# Altium schematic sheet 2-Charge&Discharge.SchDoc
size A4
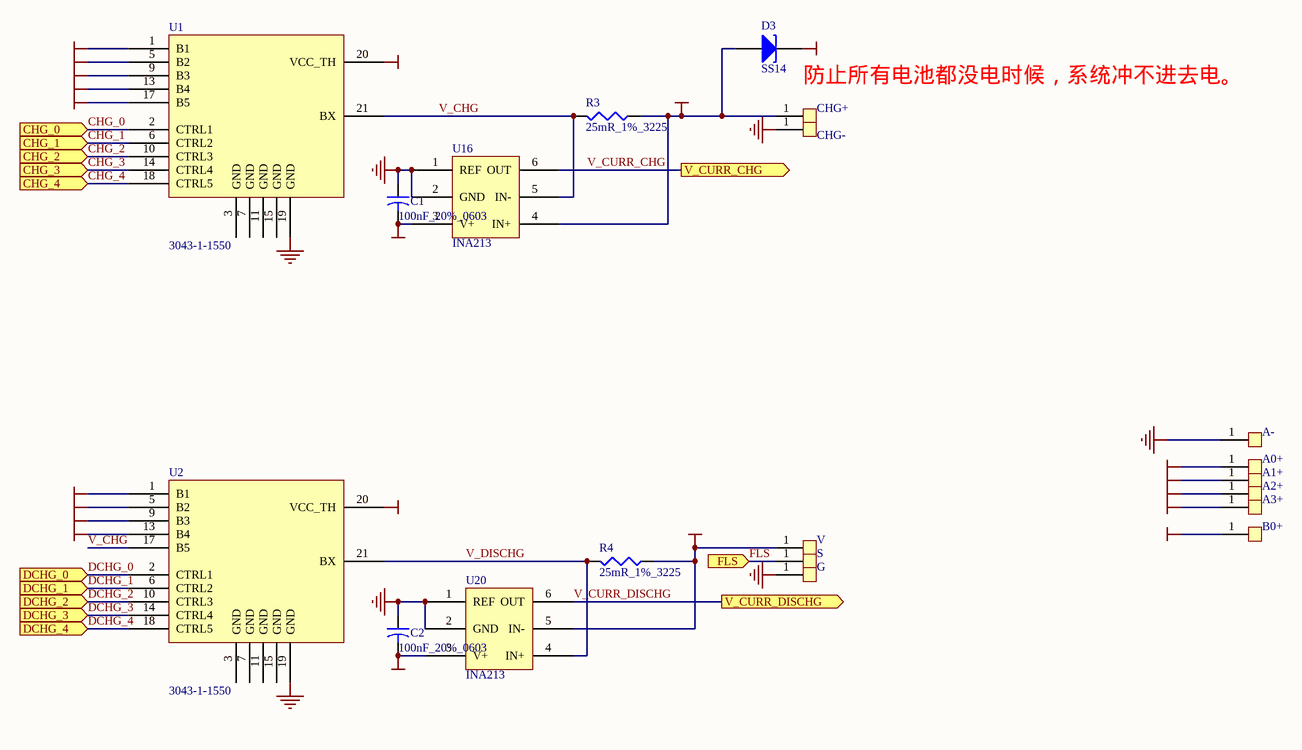
[diagram p0: 2-Charge&Discharge.SchDoc]

## Parts
A0+  ND  [END_1.5_2.8]  (value not drawn)
A1+  ND  [END_1.5_2.8]  (value not drawn)
A2+  ND  [END_1.5_2.8]  (value not drawn)
A3+  ND  [END_1.5_2.8]  (value not drawn)
A-  ND  [END_1.5_2.8]  (value not drawn)
B0+  ND  [END_1.5_2.8]  (value not drawn)
C1  100nF_20%_0603  [C1608-0603]
C2  100nF_20%_0603  [C1608-0603]
CHG+  ND  [END_1.5_2.8]  (value not drawn)
CHG-  ND  [END_1.5_2.8]  (value not drawn)
D3  SS14  [DO-214AB_SS14]
G  ND  [END_1.5_2.8]  (value not drawn)
R3  25mR_1%_3225  [CR6332-2512]
R4  25mR_1%_3225  [CR6332-2512]
S  ND  [END_1.5_2.8]  (value not drawn)
U1  3043-1-1550  [3043-1-1550_V1.10]
U2  3043-1-1550  [3043-1-1550_V1.10]
U16  INA213  [SC70-6]
U20  INA213  [SC70-6]
V  ND  [END_1.5_2.8]  (value not drawn)

## Ports
CHG_0 (in), CHG_1 (in), CHG_2 (in), CHG_3 (in), CHG_4 (in), DCHG_0 (in), DCHG_1 (in), DCHG_2 (in), DCHG_3 (in), DCHG_4 (in), FLS (in), V_CURR_CHG (out), V_CURR_DISCHG (out)

## Nets
GND: A-.1(SW) C1.1 C2.1 CHG-.1(SW) G.1(SW) U1.19(GND) U2.19(GND) U16.1(REF) U16.2(GND) U20.1(REF) U20.2(GND)
V_BAK: B0+.1(SW) D3.2(K) U1.17(B5)
V_BT0: A0+.1(SW) U1.1(B1) U2.1(B1)
V_BT1: A1+.1(SW) U1.5(B2) U2.5(B2)
V_BT2: A2+.1(SW) U1.9(B3) U2.9(B3)
V_BT3: A3+.1(SW) U1.13(B4) U2.13(B4)
VCC_2V8: C1.2 C2.2 U16.3(V+) U20.3(V+)
VCC_CHARGE: CHG+.1(SW) D3.1(A) R3.1 U16.4(IN+)
VCC_DIS: R4.1 U20.5(IN-) V.1(SW)
VCC_TH: U1.20(VCC_TH) U2.20(VCC_TH)
CHG_0: U1.2(CTRL1) ; port CHG_0
CHG_1: U1.6(CTRL2) ; port CHG_1
CHG_2: U1.10(CTRL3) ; port CHG_2
CHG_3: U1.14(CTRL4) ; port CHG_3
CHG_4: U1.18(CTRL5) ; port CHG_4
DCHG_0: U2.2(CTRL1) ; port DCHG_0
DCHG_1: U2.6(CTRL2) ; port DCHG_1
DCHG_2: U2.10(CTRL3) ; port DCHG_2
DCHG_3: U2.14(CTRL4) ; port DCHG_3
DCHG_4: U2.18(CTRL5) ; port DCHG_4
FLS: S.1(SW) ; port FLS
V_CHG: R3.2 U1.21(BX) U2.17(B5) U16.5(IN-)
V_CURR_CHG: U16.6(OUT) ; port V_CURR_CHG
V_CURR_DISCHG: U20.6(OUT) ; port V_CURR_DISCHG
V_DISCHG: R4.2 U2.21(BX) U20.4(IN+)

Not connected (* = marked no-connect by the designer): U1 3(GND) 7(GND) 11(GND) 15(GND); U2 3(GND) 7(GND) 11(GND) 15(GND)

## Notes on the sheet
- 防止所有电池都没电时候，系统冲不进去电。

## Library data of the parts
C1 C2 = Cap2: Capacitor; Value: 0.1uF 20% 0603; Published: 23-Sep-2002; Publisher: Altium Limited
D3 = D Tunnel1: Tunnel Diode - RLC Model; Published: 8-Jun-2000; LatestRevisionDate: 17-Jul-2002; LatestRevisionNote: Re-released for DXP Platform.; Publisher: Altium Limited
R3 R4 = Res3: Resistor; Value: 150R %5 0603; Published: 8-Jun-2000; Revision: July-2002: Re-released for DXP Platform.; Publisher: Altium Limited